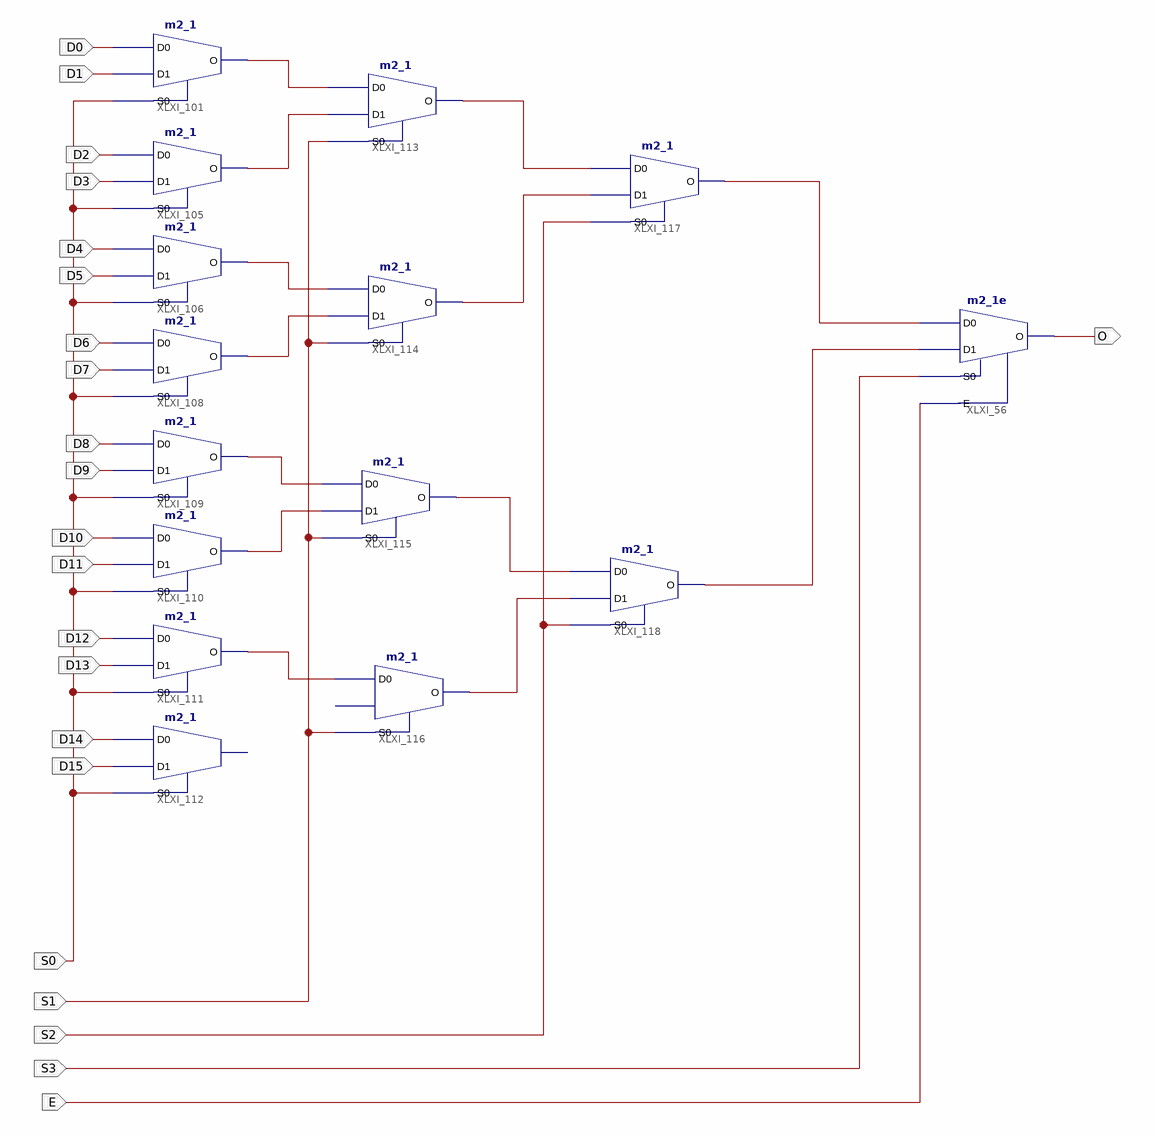
[diagram p0: schematic sheet 1]
// Xilinx ISE schematic m16_1e.sch (spartan3e) as structural Verilog: 15 symbols, 22 ports
module m16_1e (
  input  S3,
  input  S2,
  input  E,
  input  S0,
  input  D0,
  input  D1,
  input  D2,
  input  D3,
  input  D4,
  input  D5,
  input  D6,
  input  D7,
  input  D8,
  input  D9,
  input  D10,
  input  D11,
  input  D12,
  input  D13,
  input  D14,
  input  D15,
  input  S1,
  output O
);

  wire XLXN_145, XLXN_146, XLXN_147, XLXN_148, XLXN_164, XLXN_165, XLXN_167, XLXN_168, XLXN_169, XLXN_170,
       XLXN_171, XLXN_174, XLXN_175;

  m2_1e XLXI_56 (.D0(XLXN_165), .D1(XLXN_164), .E(E), .S0(S3), .O(O));
  m2_1 XLXI_101 (.D0(D0), .D1(D1), .S0(S0), .O(XLXN_167));
  m2_1 XLXI_105 (.D0(D2), .D1(D3), .S0(S0), .O(XLXN_168));
  m2_1 XLXI_106 (.D0(D4), .D1(D5), .S0(S0), .O(XLXN_169));
  m2_1 XLXI_108 (.D0(D6), .D1(D7), .S0(S0), .O(XLXN_170));
  m2_1 XLXI_109 (.D0(D8), .D1(D9), .S0(S0), .O(XLXN_171));
  m2_1 XLXI_110 (.D0(D10), .D1(D11), .S0(S0), .O(XLXN_174));
  m2_1 XLXI_111 (.D0(D12), .D1(D13), .S0(S0), .O(XLXN_175));
  m2_1 XLXI_112 (.D0(D14), .D1(D15), .S0(S0));  // open: O
  m2_1 XLXI_113 (.D0(XLXN_167), .D1(XLXN_168), .S0(S1), .O(XLXN_146));
  m2_1 XLXI_114 (.D0(XLXN_169), .D1(XLXN_170), .S0(S1), .O(XLXN_145));
  m2_1 XLXI_115 (.D0(XLXN_171), .D1(XLXN_174), .S0(S1), .O(XLXN_147));
  m2_1 XLXI_116 (.D0(XLXN_175), .S0(S1), .O(XLXN_148));  // open: D1
  m2_1 XLXI_117 (.D0(XLXN_146), .D1(XLXN_145), .S0(S2), .O(XLXN_165));
  m2_1 XLXI_118 (.D0(XLXN_147), .D1(XLXN_148), .S0(S2), .O(XLXN_164));
endmodule
